# Altium schematic sheet DIGITAL_INPUT.SchDoc: Digital input
size A3; Author: eldar6776@hotmail.com; DrawnBy: Eldar Dedic; Organization: PROVEN d.o.o.; Address1: Adema Buće 102; Address2: 71000 Sarajevo; Address3: Federacija BiH; Address4: Bosna i Hercegovina; DocumentNumber: CD-26514; Revision: 001; SheetNumber: 4; SheetTotal: 8; ProjectName: KONTROLER TRANSPORTA MATERIJALA
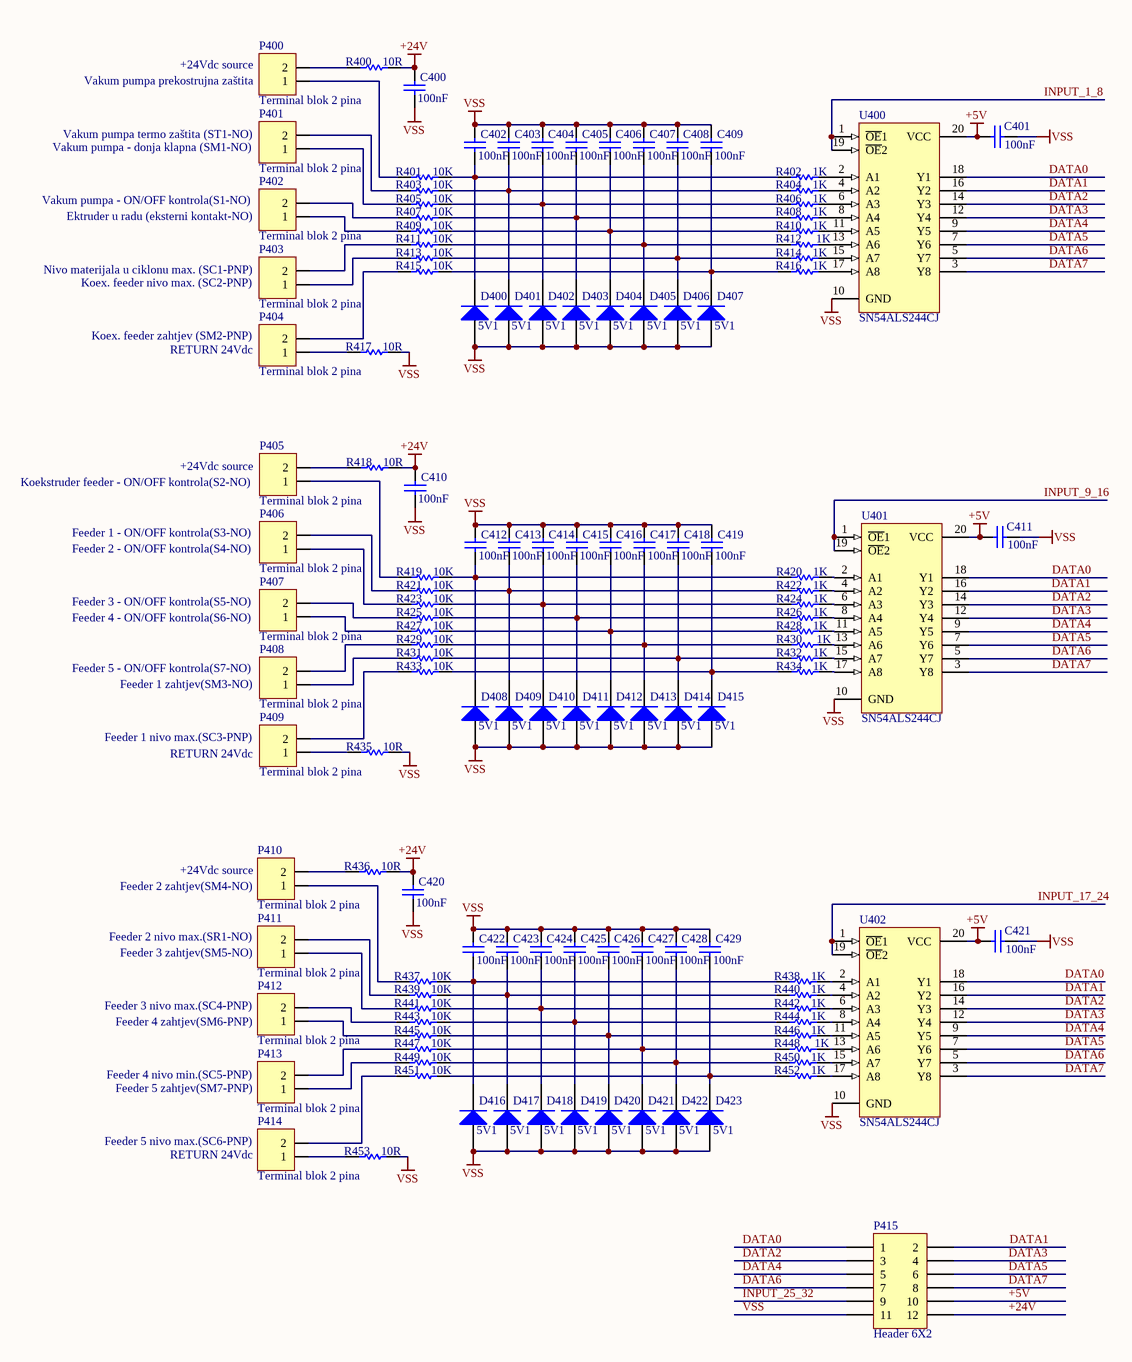
[diagram p0: DIGITAL_INPUT.SchDoc]

## Parts
C400  value 100nF  [1206]
C401  value 100nF  [1206]
C402  value 100nF  [1206]
C403  value 100nF  [1206]
C404  value 100nF  [1206]
C405  value 100nF  [1206]
C406  value 100nF  [1206]
C407  value 100nF  [1206]
C408  value 100nF  [1206]
C409  value 100nF  [1206]
C410  value 100nF  [1206]
C411  value 100nF  [1206]
C412  value 100nF  [1206]
C413  value 100nF  [1206]
C414  value 100nF  [1206]
C415  value 100nF  [1206]
C416  value 100nF  [1206]
C417  value 100nF  [1206]
C418  value 100nF  [1206]
C419  value 100nF  [1206]
C420  value 100nF  [1206]
C421  value 100nF  [1206]
C422  value 100nF  [1206]
C423  value 100nF  [1206]
C424  value 100nF  [1206]
C425  value 100nF  [1206]
C426  value 100nF  [1206]
C427  value 100nF  [1206]
C428  value 100nF  [1206]
C429  value 100nF  [1206]
D400  5V1  [SOD80C]
D401  5V1  [SOD80C]
D402  5V1  [SOD80C]
D403  5V1  [SOD80C]
D404  5V1  [SOD80C]
D405  5V1  [SOD80C]
D406  5V1  [SOD80C]
D407  5V1  [SOD80C]
D408  5V1  [SOD80C]
D409  5V1  [SOD80C]
D410  5V1  [SOD80C]
D411  5V1  [SOD80C]
D412  5V1  [SOD80C]
D413  5V1  [SOD80C]
D414  5V1  [SOD80C]
D415  5V1  [SOD80C]
D416  5V1  [SOD80C]
D417  5V1  [SOD80C]
D418  5V1  [SOD80C]
D419  5V1  [SOD80C]
D420  5V1  [SOD80C]
D421  5V1  [SOD80C]
D422  5V1  [SOD80C]
D423  5V1  [SOD80C]
P400  Terminal blok 2 pina  [TERMINAL BLOK 2]
P401  Terminal blok 2 pina  [TERMINAL BLOK 2]
P402  Terminal blok 2 pina  [TERMINAL BLOK 2]
P403  Terminal blok 2 pina  [TERMINAL BLOK 2]
P404  Terminal blok 2 pina  [TERMINAL BLOK 2]
P405  Terminal blok 2 pina  [TERMINAL BLOK 2]
P406  Terminal blok 2 pina  [TERMINAL BLOK 2]
P407  Terminal blok 2 pina  [TERMINAL BLOK 2]
P408  Terminal blok 2 pina  [TERMINAL BLOK 2]
P409  Terminal blok 2 pina  [TERMINAL BLOK 2]
P410  Terminal blok 2 pina  [TERMINAL BLOK 2]
P411  Terminal blok 2 pina  [TERMINAL BLOK 2]
P412  Terminal blok 2 pina  [TERMINAL BLOK 2]
P413  Terminal blok 2 pina  [TERMINAL BLOK 2]
P414  Terminal blok 2 pina  [TERMINAL BLOK 2]
P415  Header 6X2  [HDR2X6]
R400  10R  [ERA-0805]
R401  10K  [ERA-0805]
R402  1K  [ERA-0805]
R403  10K  [ERA-0805]
R404  1K  [ERA-0805]
R405  10K  [ERA-0805]
R406  1K  [ERA-0805]
R407  10K  [ERA-0805]
R408  1K  [ERA-0805]
R409  10K  [ERA-0805]
R410  1K  [ERA-0805]
R411  10K  [ERA-0805]
R412  1K  [ERA-0805]
R413  10K  [ERA-0805]
R414  1K  [ERA-0805]
R415  10K  [ERA-0805]
R416  1K  [ERA-0805]
R417  10R  [ERA-0805]
R418  10R  [ERA-0805]
R419  10K  [ERA-0805]
R420  1K  [ERA-0805]
R421  10K  [ERA-0805]
R422  1K  [ERA-0805]
R423  10K  [ERA-0805]
R424  1K  [ERA-0805]
R425  10K  [ERA-0805]
R426  1K  [ERA-0805]
R427  10K  [ERA-0805]
R428  1K  [ERA-0805]
R429  10K  [ERA-0805]
R430  1K  [ERA-0805]
R431  10K  [ERA-0805]
R432  1K  [ERA-0805]
R433  10K  [ERA-0805]
R434  1K  [ERA-0805]
R435  10R  [ERA-0805]
R436  10R  [ERA-0805]
R437  10K  [ERA-0805]
R438  1K  [ERA-0805]
R439  10K  [ERA-0805]
R440  1K  [ERA-0805]
R441  10K  [ERA-0805]
R442  1K  [ERA-0805]
R443  10K  [ERA-0805]
R444  1K  [ERA-0805]
R445  10K  [ERA-0805]
R446  1K  [ERA-0805]
R447  10K  [ERA-0805]
R448  1K  [ERA-0805]
R449  10K  [ERA-0805]
R450  1K  [ERA-0805]
R451  10K  [ERA-0805]
R452  1K  [ERA-0805]
R453  10R  [ERA-0805]
U400  SN54ALS244CJ  [J020]
U401  SN54ALS244CJ  [J020]
U402  SN54ALS244CJ  [J020]

## Nets
+5V: C401.1 C411.1 C421.1 P415.10 U400.20(VCC) U401.20(VCC) U402.20(VCC)
+24V: C400.2 C410.2 C420.2 P415.12 R400.2 R418.2 R436.2
VSS: C400.1 C401.2 C402.2 C403.2 C404.2 C405.2 C406.2 C407.2 C408.2 C409.2 C410.1 C411.2 C412.2 C413.2 C414.2 C415.2 C416.2 C417.2 C418.2 C419.2 C420.1 C421.2 C422.2 C423.2 C424.2 C425.2 C426.2 C427.2 C428.2 C429.2 D400.1(A) D401.1(A) D402.1(A) D403.1(A) D404.1(A) D405.1(A) D406.1(A) D407.1(A) D408.1(A) D409.1(A) D410.1(A) D411.1(A) D412.1(A) D413.1(A) D414.1(A) D415.1(A) D416.1(A) D417.1(A) D418.1(A) D419.1(A) D420.1(A) D421.1(A) D422.1(A) D423.1(A) P415.11 R417.2 R435.2 R453.2 U400.10(GND) U401.10(GND) U402.10(GND)
DATA0: P415.1 U400.18(Y1) U401.18(Y1) U402.18(Y1)
DATA1: P415.2 U400.16(Y2) U401.16(Y2) U402.16(Y2)
DATA2: P415.3 U400.14(Y3) U401.14(Y3) U402.14(Y3)
DATA3: P415.4 U400.12(Y4) U401.12(Y4) U402.12(Y4)
DATA4: P415.5 U400.9(Y5) U401.9(Y5) U402.9(Y5)
DATA5: P415.6 U400.7(Y6) U401.7(Y6) U402.7(Y6)
DATA6: P415.7 U400.5(Y7) U401.5(Y7) U402.5(Y7)
DATA7: P415.8 U400.3(Y8) U401.3(Y8) U402.3(Y8)
INPUT_1_8: U400.1(~{OE}1) U400.19(~{OE}2)
INPUT_9_16: U401.1(~{OE}1) U401.19(~{OE}2)
INPUT_17_24: U402.1(~{OE}1) U402.19(~{OE}2)
INPUT_25_32: P415.9
NetC402_1: C402.1 D400.2(K) R401.2 R402.1
NetC403_1: C403.1 D401.2(K) R403.2 R404.1
NetC404_1: C404.1 D402.2(K) R405.2 R406.1
NetC405_1: C405.1 D403.2(K) R407.2 R408.1
NetC406_1: C406.1 D404.2(K) R409.2 R410.1
NetC407_1: C407.1 D405.2(K) R411.2 R412.1
NetC408_1: C408.1 D406.2(K) R413.2 R414.1
NetC409_1: C409.1 D407.2(K) R415.2 R416.1
NetC412_1: C412.1 D408.2(K) R419.2 R420.1
NetC413_1: C413.1 D409.2(K) R421.2 R422.1
NetC414_1: C414.1 D410.2(K) R423.2 R424.1
NetC415_1: C415.1 D411.2(K) R425.2 R426.1
NetC416_1: C416.1 D412.2(K) R427.2 R428.1
NetC417_1: C417.1 D413.2(K) R429.2 R430.1
NetC418_1: C418.1 D414.2(K) R431.2 R432.1
NetC419_1: C419.1 D415.2(K) R433.2 R434.1
NetC422_1: C422.1 D416.2(K) R437.2 R438.1
NetC423_1: C423.1 D417.2(K) R439.2 R440.1
NetC424_1: C424.1 D418.2(K) R441.2 R442.1
NetC425_1: C425.1 D419.2(K) R443.2 R444.1
NetC426_1: C426.1 D420.2(K) R445.2 R446.1
NetC427_1: C427.1 D421.2(K) R447.2 R448.1
NetC428_1: C428.1 D422.2(K) R449.2 R450.1
NetC429_1: C429.1 D423.2(K) R451.2 R452.1
NetP400_1: P400.1 R401.1
NetP400_2: P400.2 R400.1
NetP401_1: P401.1 R405.1
NetP401_2: P401.2 R403.1
NetP402_1: P402.1 R409.1
NetP402_2: P402.2 R407.1
NetP403_1: P403.1 R413.1
NetP403_2: P403.2 R411.1
NetP404_1: P404.1 R417.1
NetP404_2: P404.2 R415.1
NetP405_1: P405.1 R419.1
NetP405_2: P405.2 R418.1
NetP406_1: P406.1 R423.1
NetP406_2: P406.2 R421.1
NetP407_1: P407.1 R427.1
NetP407_2: P407.2 R425.1
NetP408_1: P408.1 R431.1
NetP408_2: P408.2 R429.1
NetP409_1: P409.1 R435.1
NetP409_2: P409.2 R433.1
NetP410_1: P410.1 R437.1
NetP410_2: P410.2 R436.1
NetP411_1: P411.1 R441.1
NetP411_2: P411.2 R439.1
NetP412_1: P412.1 R445.1
NetP412_2: P412.2 R443.1
NetP413_1: P413.1 R449.1
NetP413_2: P413.2 R447.1
NetP414_1: P414.1 R453.1
NetP414_2: P414.2 R451.1
NetR402_2: R402.2 U400.2(A1)
NetR404_2: R404.2 U400.4(A2)
NetR406_2: R406.2 U400.6(A3)
NetR408_2: R408.2 U400.8(A4)
NetR410_2: R410.2 U400.11(A5)
NetR412_2: R412.2 U400.13(A6)
NetR414_2: R414.2 U400.15(A7)
NetR416_2: R416.2 U400.17(A8)
NetR420_2: R420.2 U401.2(A1)
NetR422_2: R422.2 U401.4(A2)
NetR424_2: R424.2 U401.6(A3)
NetR426_2: R426.2 U401.8(A4)
NetR428_2: R428.2 U401.11(A5)
NetR430_2: R430.2 U401.13(A6)
NetR432_2: R432.2 U401.15(A7)
NetR434_2: R434.2 U401.17(A8)
NetR438_2: R438.2 U402.2(A1)
NetR440_2: R440.2 U402.4(A2)
NetR442_2: R442.2 U402.6(A3)
NetR444_2: R444.2 U402.8(A4)
NetR446_2: R446.2 U402.11(A5)
NetR448_2: R448.2 U402.13(A6)
NetR450_2: R450.2 U402.15(A7)
NetR452_2: R452.2 U402.17(A8)

## Notes on the sheet
- (near P400) Vakum pumpa prekostrujna zaštita
- (near P400) +24Vdc source
- (near P401) Vakum pumpa - donja klapna (SM1-NO)
- (near P401) Vakum pumpa termo zaštita (ST1-NO)
- (near P402) Vakum pumpa - ON/OFF kontrola(S1-NO)
- (near P402) Ektruder u radu (eksterni kontakt-NO)
- (near P403) Nivo materijala u ciklonu max. (SC1-PNP)
- (near P403) Koex. feeder nivo max. (SC2-PNP)
- (near P404) Koex. feeder zahtjev (SM2-PNP)
- RETURN 24Vdc
- (near P405) Koekstruder feeder - ON/OFF kontrola(S2-NO)
- (near P405) +24Vdc source
- (near P406) Feeder 1 - ON/OFF kontrola(S3-NO)
- (near P406) Feeder 2 - ON/OFF kontrola(S4-NO)
- (near P407) Feeder 3 - ON/OFF kontrola(S5-NO)
- (near P407) Feeder 4 - ON/OFF kontrola(S6-NO)
- (near P408) Feeder 5 - ON/OFF kontrola(S7-NO)
- (near P408) Feeder 1 zahtjev(SM3-NO)
- (near P409) Feeder 1 nivo max.(SC3-PNP)
- (near P410) Feeder 2 zahtjev(SM4-NO)
- (near P410) +24Vdc source
- (near P411) Feeder 2 nivo max.(SR1-NO)
- (near P411) Feeder 3 zahtjev(SM5-NO)
- (near P412) Feeder 3 nivo max.(SC4-PNP)
- (near P412) Feeder 4 zahtjev(SM6-PNP)
- (near P413) Feeder 4 nivo min.(SC5-PNP)
- (near P413) Feeder 5 zahtjev(SM7-PNP)
- (near P414) Feeder 5 nivo max.(SC6-PNP)
- Title
- Size:
- Date:
- A3
- Number:
- Time:
- Revision:
- Sheet
- of
- File:

## Library data of the parts
C400-C429 = C1206: Ceramic Chip Capacitor - Standard; Published: 17-Jul-2002; LatestRevisionDate: 19-Mar-2004; LatestRevisionNote: Silkscreen size reduced.; DatasheetDocument: Mar-2001; PackageDocument: Mar-2001; PackageReference: 1206; Publisher: Altium Limited; Code_JEITA: 1206; Code_IPC: 3216 [1206]; ComponentLink1Description: Manufacturer Link; ComponentLink1URL: http://www.kemet.com/; ComponentLink2Description: Datasheet; ComponentLink2URL: http://www.kemet.com/kemet/web/homepage/kechome.nsf/vapubfilesname/F3102TA.pdf/$file/F3102TA.pdf
D400-D423 = BZV85-C5V1: Voltage Regulator Diode; Published: 17-Sep-2003; DatasheetVersion: 11-May-1999; PackageVersion: May-1999; PackageReference: SOD66; Publisher: Altium Limited; PackageDescription: Diode, Axial; Body 4.8 x 2.6 mm (LxDia. max), Lead Dia. 0.81 mm (max); Code_JEDEC: DO-204-AL; ComponentLink1Description: Manufacturer Link; ComponentLink1URL: http://www.semiconductors.philips.com/; ComponentLink2Description: Datasheet; ComponentLink2URL: http://www.semiconductors.philips.com/acrobat/datasheets/BZV85_2.pdf
P400-P414 = Terminal blok 2 pina: Terminal blok 2
P415 = Header 6X2: Header, 6-Pin, Dual row; LatestRevisionDate: 17-Jul-2002; LatestRevisionNote: Re-released for DXP Platform.; Publisher: Altium Limited
R400-R453 = ERA6Y: Rectangular Thick Film Chip Resistor, 10 Ohm to 1M Ohm Range, 0.1% and 0.5% Tolerance, 0805 Size, 0.1 W; Note: If flow soldering, adjust pad width of PCB Footprint to 0.7 - 0.8 times the width of the resistor.; Published: 17-Dec-2003; LatestRevisionDate: 19-Mar-2004; LatestRevisionNote: Silkscreen size reduced.; PackageDocument: Mar-2003; PackageReference: ERA-0805; Publisher: Altium Limited; Code_IPC: 2012 [0805]; ComponentLink1Description: Manufacturer Link; ComponentLink1URL: http://www.panasonic.com/industrial/components/resistive_products.htm; ComponentLink2Description: Datasheet; ComponentLink2URL: http://www.panasonic.com/industrial/components/pdf/AOA0000CE8.pdf
U400-U402 = SN54ALS244CJ: Octal Buffer/Driver with 3-State Outputs; Published: 8-Jun-2000; LatestRevisionDate: 06-Jun-2005; LatestRevisionNote: Stylized 3D Model Added.; DatasheetVersion: Aug-1995; PackageVersion: Jun-1999; PackageReference: J020; Publisher: Altium Limited; PackageDescription: DIP; 20 Leads; Row Spacing 7.62 mm; Pitch 2.54 mm; ComponentLink1Description: Manufacturer Link; ComponentLink1URL: http://www.ti.com/; ComponentLink2Description: Datasheet; ComponentLink2URL: http://www-s.ti.com/sc/ds/sn74als244c.pdf